# Altium schematic sheet Plasma Speaker.SchDoc
size A
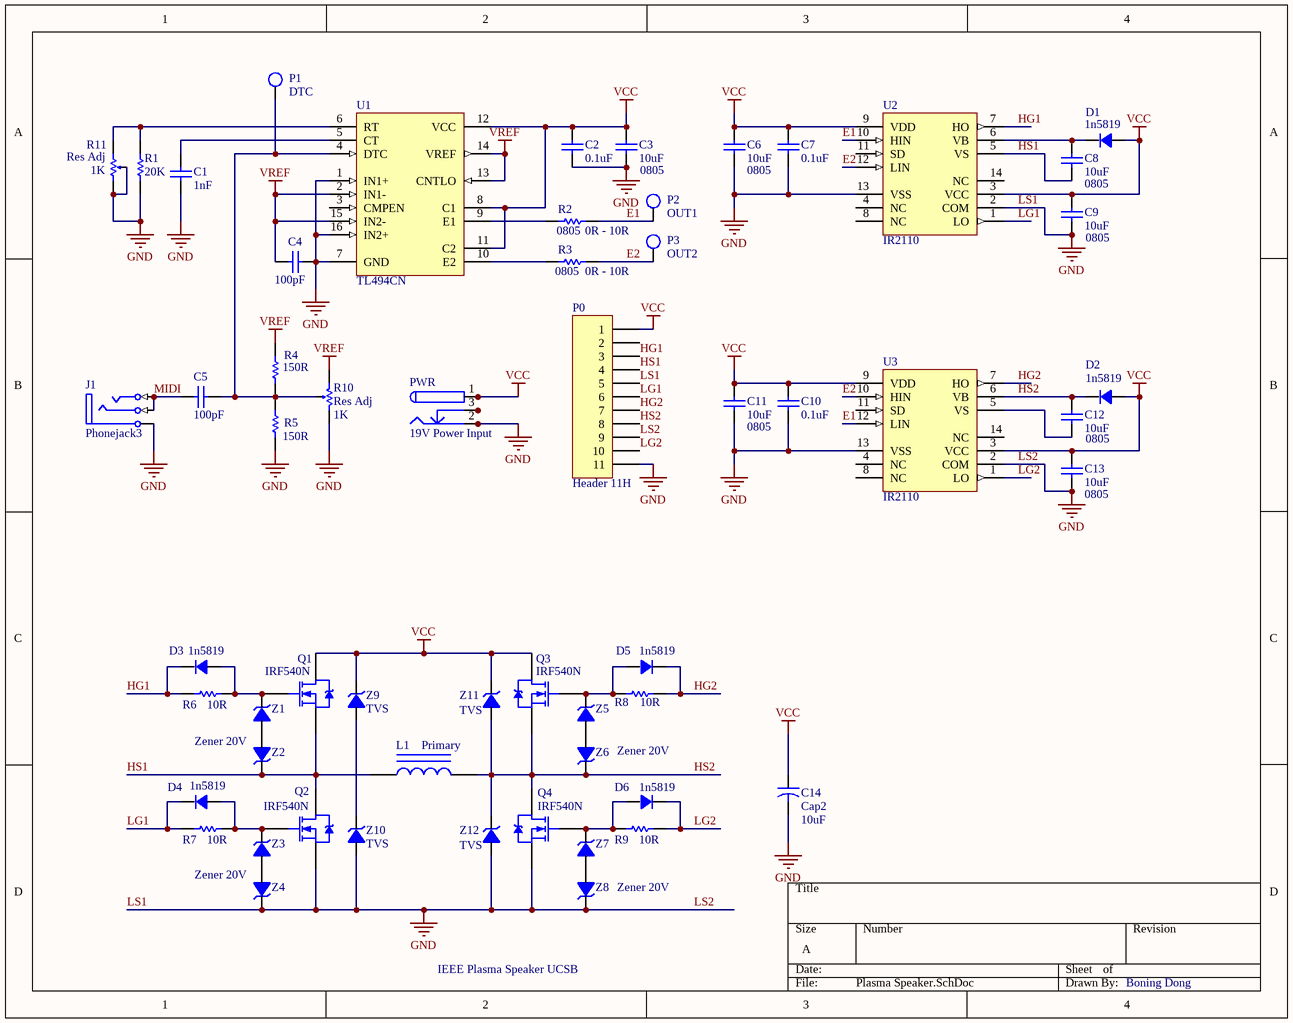
[diagram p0: Plasma Speaker.SchDoc]

## Parts
C1  value 1nF  [RAD-0.3]  (hidden comment: 0603)
C2  value 0.1uF  [RAD-0.3]  (hidden comment: 0603)
C3  0805  value 10uF  [RAD-0.3]
C4  value 100pF  [RAD-0.3]  (hidden comment: 0603)
C5  value 100pF  [RAD-0.3]  (hidden comment: 0603)
C6  0805  value 10uF  [RAD-0.3]
C7  value 0.1uF  [RAD-0.3]  (hidden comment: 0603)
C8  0805  value 10uF  [RAD-0.3]
C9  0805  value 10uF  [RAD-0.3]
C10  value 0.1uF  [RAD-0.3]  (hidden comment: 0603)
C11  0805  value 10uF  [RAD-0.3]
C12  0805  value 10uF  [RAD-0.3]
C13  0805  value 10uF  [RAD-0.3]
C14  Cap2  value 10uF  [CAPR5-4X5]
D1  1n5819  [DIODE-0.7]
D2  1n5819  [DIODE-0.7]
D3  1n5819  [DIODE-0.7]
D4  1n5819  [DIODE-0.7]
D5  1n5819  [DIODE-0.7]
D6  1n5819  [DIODE-0.7]
J1  Phonejack3  [JACK/6-V3]
L1  value Primary  [AXIAL-0.9]  (hidden comment: Inductor Iron)
P0  Header 11H  [HDR1X11H]
P1  DTC
P2  OUT1
P3  OUT2
PWR  19V Power Input  [KLD-0202]
Q1  IRF540N  [TO-220AB]
Q2  IRF540N  [TO-220AB]
Q3  IRF540N  [TO-220AB]
Q4  IRF540N  [TO-220AB]
R1  value 20K  [AXIAL-0.3]  (hidden comment: 0603)
R2  0805  value 0R - 10R  [AXIAL-0.3]
R3  0805  value 0R - 10R  [AXIAL-0.3]
R4  value 150R  [AXIAL-0.3]  (hidden comment: 0603)
R5  value 150R  [AXIAL-0.3]  (hidden comment: 0603)
R6  value 10R  [AXIAL-0.3]  (hidden comment: 0805)
R7  value 10R  [AXIAL-0.3]  (hidden comment: 0805)
R8  value 10R  [AXIAL-0.3]  (hidden comment: 0805)
R9  value 10R  [AXIAL-0.3]  (hidden comment: 0805)
R10  Res Adj  value 1K  [AXIAL-0.3]
R11  Res Adj  value 1K  [AXIAL-0.3]
U1  TL494CN  [648-06]
U2  IR2110  [PDIP14]
U3  IR2110  [PDIP14]
Z1  Zener 20V  [DIODE-0.7]
Z2  Zener  [DIODE-0.7]  (value not drawn)
Z3  Zener 20V  [DIODE-0.7]
Z4  Zener  [DIODE-0.7]  (value not drawn)
Z5  Zener 20V  [DIODE-0.7]
Z6  Zener  [DIODE-0.7]  (value not drawn)
Z7  Zener 20V  [DIODE-0.7]
Z8  Zener  [DIODE-0.7]  (value not drawn)
Z9  TVS  [DIODE-0.7]
Z10  TVS  [DIODE-0.7]
Z11  TVS  [DIODE-0.7]
Z12  TVS  [DIODE-0.7]

## Nets
LS1: C1.1 C2.1 C3.1 C4.1 C6.1 C7.1 C9.1 C10.1 C11.1 C13.1 C14.2 J1.5(S) P0.5 P0.9 P0.11 PWR.2 PWR.2A PWR.2B Q2.3(S) Q4.3(S) R1.1 R5.1 R10.3 R11.2 R11.3 U1.1(IN1+) U1.7(GND) U1.16(IN2+) U2.2(COM) U2.13(VSS) U3.2(COM) U3.13(VSS) Z4.2 Z8.2 Z10.1 Z12.1  [also labelled GND, LS2]
VCC: C2.2 C3.2 C6.2 C7.2 C9.2 C10.2 C11.2 C13.2 C14.1 D1.1 D2.1 P0.1 PWR.1 PWR.1A PWR.1B Q1.2(D) Q3.2(D) U1.8(C1) U1.11(C2) U1.12(VCC) U2.3(VCC) U2.9(VDD) U3.3(VCC) U3.9(VDD) Z9.2 Z11.2
VREF: C4.2 R4.2 R10.1 U1.2(IN1-) U1.13(CNTLO) U1.14(VREF) U1.15(IN2-)
E1: P2.1 R2.1 U2.10(HIN) U3.12(LIN)
E2: P3.1 R3.1 U2.12(LIN) U3.10(HIN)
HG1: D3.2 P0.3 R6.2 U2.7(HO)
HG2: D5.2 P0.7 R8.1 U3.7(HO)
HS1: C8.1 L1.1 P0.4 Q1.3(S) Q2.2(D) U2.5(VS) Z2.2
HS2: C12.2 D2.2 L1.2 P0.8 Q3.3(S) Q4.2(D) U3.6(VB) Z6.2 Z11.1 Z12.2
LG1: D4.2 P0.6 R7.2 U2.1(LO)
LG2: D6.2 P0.10 R9.1 U3.1(LO)
MIDI: C5.1 J1.1(T) J1.3(R)
NetC1_2: C1.2 U1.5(CT)
NetC5_2: C5.2 P1.1 R4.1 R5.2 R10.2 U1.4(DTC)
NetC8_2: C8.2 D1.2 U2.6(VB)
NetC12_1: C12.1 U3.5(VS)
NetD3_1: D3.1 Q1.1(G) R6.1 Z1.2
NetD4_1: D4.1 Q2.1(G) R7.1 Z3.2
NetD5_1: D5.1 Q3.1(G) R8.2 Z5.2
NetD6_1: D6.1 Q4.1(G) R9.2 Z7.2
NetPWR_3: PWR.3 PWR.3A PWR.3B
NetR1_2: R1.2 R11.1 U1.6(RT)
NetR2_2: R2.2 U1.9(E1)
NetR3_2: R3.2 U1.10(E2)
NetZ1_1: Z1.1 Z2.1
NetZ3_1: Z3.1 Z4.1
NetZ5_1: Z5.1 Z6.1
NetZ7_1: Z7.1 Z8.1
NetZ9_1: Z9.1 Z10.2

Not connected (* = marked no-connect by the designer): P0 2; U1 3(CMPEN); U2 4(NC) 8(NC) 11(SD) 14(NC); U3 4(NC) 8(NC) 11(SD) 14(NC)

## Notes on the sheet
- IEEE Plasma Speaker UCSB
- Boning Dong

## Library data of the parts
C1-C13 = Cap: Capacitor; Published: 8-Jun-2000; LatestRevisionDate: 17-Jul-2002; LatestRevisionNote: Re-released for DXP Platform.; PackageReference: RAD-0.3; Publisher: Altium Limited; PackageDescription: Radial Cap, Thru-Hole; 2 Leads; 0.3 in Pin Spacing
C14 = Cap2: Capacitor; Published: 23-Sep-2002; PackageReference: CAPR5-4X5; Publisher: Altium Limited; PackageDescription: Capacitor; 2 Leads
D1-D6 = Diode S: Zener Diode; Published: 8-Jun-2000; LatestRevisionDate: 17-Jul-2002; LatestRevisionNote: Re-released for DXP Platform.; PackageReference: DIODE-0.7; Publisher: Altium Limited; PackageDescription: Diode, Thru-Hole; 2 Leads; 0.7 in Pin Spacing
J1 = Phonejack3: Jack Socket, 1/4" [6.5mm], Thru-Hole, Vertical, 3-Conductor Open Circuit (Non-Normalling); PackageDocument: 2003; PCB_Layout: Complies with manufacturer's recommendation.; DrillAndSlotSize: Corresponds to nominal value.; Published: 15-Jul-2004; LatestRevisionDate: 15-Jul-2004; LatestRevisionNote: Component Replaced.; DatasheetDocument: 2003; PackageReference: S1VS_SSS; Publisher: Altium Limited; ComponentLink1Description: Manufacturer Link; ComponentLink1URL: http://www.cliffuk.co.uk/
L1 = Inductor Iron: Magnetic-Core Inductor; Published: 24-Mar-1999; LatestRevisionDate: 17-Jul-2002; LatestRevisionNote: Re-released for DXP Platform.; PackageReference: AXIAL-0.9; Publisher: Altium Limited; PackageDescription: Axial Device, Thru-Hole; 2 Leads; 0.9 in Pin Spacing
P0 = Header 11H: Header, 11-Pin, Right Angle; LatestRevisionDate: 17-Jul-2002; LatestRevisionNote: Re-released for DXP Platform.; Publisher: Altium Limited
P1-P3 = TP: Test Point
PWR = PWR2.5: Low Voltage Power Supply Connector; Published: 17-Dec-2003; DatasheetDocument: 09-May-2002; Publisher: Altium Limited; ComponentLink1Description: Manufacturer Link; ComponentLink1URL: http://domino.kycon.com/internet/Products.html
Q1-Q4 = IRF540N: N-Channel Power MOSFET; Note: Pin 2 is electrically connected to pin 4.; Published: 8-Jun-2000; LatestRevisionDate: 17-Jul-2002; LatestRevisionNote: Re-released for DXP Platform.; DatasheetVersion: PD-9.814; PackageVersion: Feb-1997; PackageReference: TO-220AB; Publisher: Altium Limited; PackageDescription: TO, Thru-Hole, Vertical, Heatsink Mounted; 3 In-Line Leads; Pitch 2.54 mm; ComponentLink1Description: Manufacturer Link; ComponentLink1URL: http://www.irf.com/
R1-R9 = Res1: Resistor; Published: 8-Jun-2000; LatestRevisionDate: 17-Jul-2002; LatestRevisionNote: Re-released for DXP Platform.; PackageReference: AXIAL-0.3; Publisher: Altium Limited; PackageDescription: Axial Device, Thru-Hole; 2 Leads; 0.3 in Pin Spacing
R10 R11 = Res Adj: Resistor; Published: 8-Jun-2000; LatestRevisionDate: 17-Jul-2002; LatestRevisionNote: Re-released for DXP Platform.; PackageReference: AXIAL-0.3; Publisher: Altium Limited; PackageDescription: Axial Device, Thru-Hole; 2 Leads; 0.3 in Pin Spacing
U1 = TL494CN: Switchmode Pulse Width Modulation Control Circuit; Published: 17-Jul-2002; LatestRevisionDate: 06-Jun-2005; LatestRevisionNote: Stylized 3D Model Added.; DatasheetVersion: 1988; PackageReference: 648-06; Publisher: Altium Limited; PackageDescription: DIP; 16 Leads; Row Spacing 7.62 mm; Pitch 2.54 mm; ComponentLink1Description: Manufacturer Link; ComponentLink1URL: http://www.onsemi.com/site/products/taxonomy/0,4438,503,00.html
U2 U3 = IR2110: High and Low Side Driver; Note: Pins 4, 8 and 14 are not connected; Published: 8-Jun-2000; LatestRevisionDate: 04-Mar-2005; LatestRevisionNote: Stylized 3D Model Added.; DatasheetVersion: PD60147J; PackageReference: PDIP14; Publisher: Altium Limited; PackageDescription: DIP; 14 Leads; Row Spacing 7.62 mm; Pitch 2.54 mm; ComponentLink1Description: Manufacturer Link; ComponentLink1URL: http://www.irf.com/; ComponentLink2Description: Datasheet; ComponentLink2URL: http://www.irf.com/product-info/datasheets/data/ir2110.pdf
Z1-Z12 = Zener: Zener Diode; Published: 8-Jun-2000; LatestRevisionDate: 17-Jul-2002; LatestRevisionNote: Re-released for DXP Platform.; PackageReference: DIODE-0.7; Publisher: Altium Limited; PackageDescription: Diode, Thru-Hole; 2 Leads; 0.7 in Pin Spacing